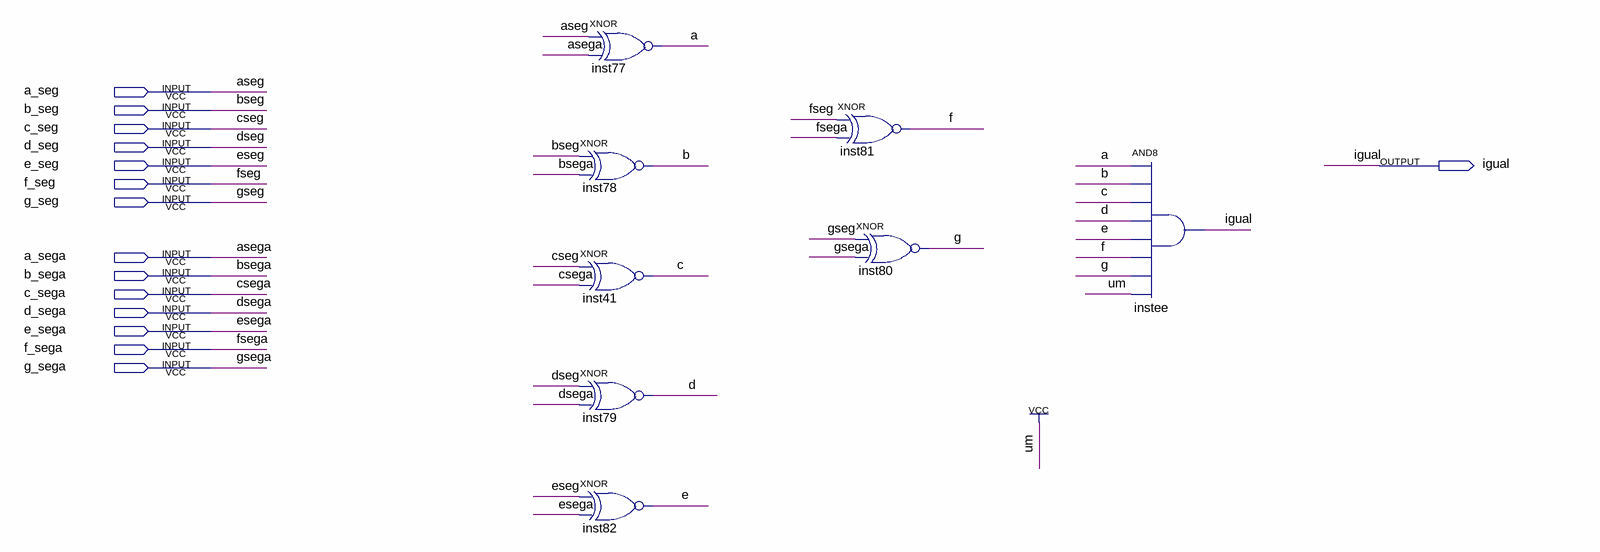
[diagram p0: schematic sheet]
// Quartus schematic dispara_alarme.bdf as structural Verilog: 8 symbols, 15 pins
module dispara_alarme (
  input  a_seg,
  input  b_seg,
  input  c_seg,
  input  d_seg,
  input  e_seg,
  input  f_seg,
  input  g_seg,
  input  a_sega,
  input  b_sega,
  input  c_sega,
  input  d_sega,
  input  e_sega,
  input  f_sega,
  input  g_sega,
  output igual
);

  wire a, b, c, d, e, f, g;

  xnor inst77 (a, a_seg, a_sega);
  xnor inst78 (b, b_seg, b_sega);
  xnor inst41 (c, c_seg, c_sega);
  xnor inst79 (d, d_seg, d_sega);
  xnor inst82 (e, e_seg, e_sega);
  xnor inst81 (f, f_seg, f_sega);
  xnor inst80 (g, g_seg, g_sega);
  and instee (igual, a, b, c, d, e, f, g, 1'b1);

  // Other names for the same wires on the sheet: aseg = a_seg; asega = a_sega; bseg = b_seg; bsega = b_sega;
  //   cseg = c_seg; csega = c_sega; dseg = d_seg; dsega = d_sega; eseg = e_seg; esega = e_sega; fseg = f_seg;
  //   fsega = f_sega; gseg = g_seg; gsega = g_sega
endmodule
